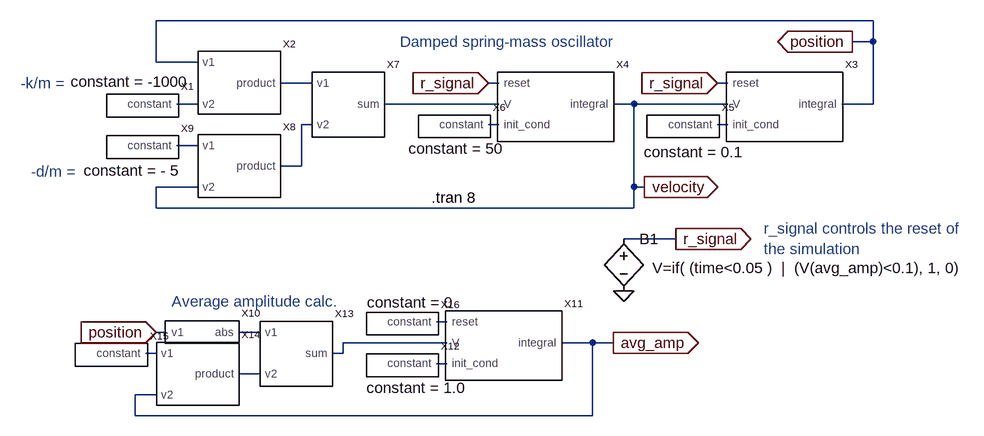
[diagram p0: schematic damped_osc_test.asc]
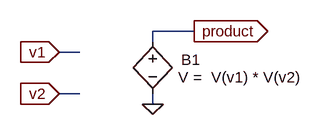
[diagram p1: sub-circuit multiplier_module.asc]
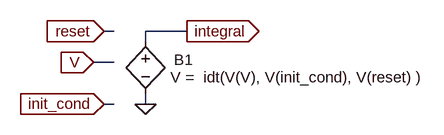
[diagram p2: sub-circuit integrator_module.asc]
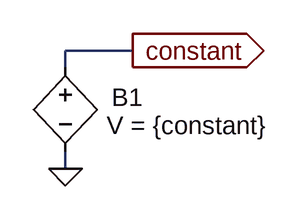
[diagram p3: sub-circuit constant_module.asc]
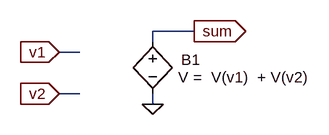
[diagram p4: sub-circuit sum_module.asc]
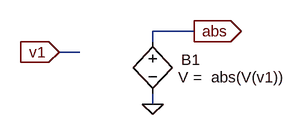
[diagram p5: sub-circuit abs_module.asc]
damped_osc_test.asc, the LTspice schematic file:
Version 4
SHEET 1 1332 680
WIRE 736 -256 -368 -256
WIRE 736 -224 736 -256
WIRE 736 -224 704 -224
WIRE -368 -192 -368 -256
WIRE -304 -192 -368 -192
WIRE -128 -160 -176 -160
WIRE 160 -160 144 -160
WIRE 512 -160 496 -160
WIRE -304 -128 -336 -128
WIRE 160 -128 -16 -128
WIRE 368 -128 336 -128
WIRE 512 -128 368 -128
WIRE 736 -128 736 -224
WIRE 736 -128 688 -128
WIRE -128 -96 -144 -96
WIRE 160 -96 144 -96
WIRE 512 -96 496 -96
WIRE -304 -64 -336 -64
WIRE -144 -32 -144 -96
WIRE -144 -32 -176 -32
WIRE -304 0 -368 0
WIRE 368 0 368 -128
WIRE 384 0 368 0
WIRE -368 32 -368 0
WIRE 368 32 368 0
WIRE 368 32 -368 32
WIRE 432 80 352 80
WIRE 80 208 64 208
WIRE -352 224 -368 224
WIRE -208 224 -240 224
WIRE 80 240 -80 240
WIRE 304 240 256 240
WIRE 336 240 304 240
WIRE -368 256 -384 256
WIRE -80 256 -80 240
WIRE -80 256 -96 256
WIRE 80 272 64 272
WIRE -208 288 -240 288
WIRE -368 320 -400 320
WIRE -400 352 -400 320
WIRE 304 352 304 240
WIRE 304 352 -400 352
FLAG 704 -224 position
IOPIN 704 -224 Out
FLAG 384 0 velocity
IOPIN 384 0 Out
FLAG 352 160 0
FLAG 432 80 r_signal
IOPIN 432 80 Out
FLAG 144 -160 r_signal
IOPIN 144 -160 In
FLAG 496 -160 r_signal
IOPIN 496 -160 In
FLAG -368 224 position
IOPIN -368 224 In
FLAG 336 240 avg_amp
IOPIN 336 240 Out
SYMBOL multiplier_module -208 -176 R0
SYMATTR InstName X2
SYMBOL integrator_module 656 -144 R0
SYMATTR InstName X3
SYMBOL integrator_module 304 -144 R0
SYMATTR InstName X4
SYMBOL constant_module 464 -112 R0
WINDOW 39 -81 58 Left 0
SYMATTR SpiceLine constant = 0.1
SYMATTR InstName X5
SYMBOL constant_module 112 -112 R0
WINDOW 39 -91 53 Left 0
SYMATTR SpiceLine constant = 50
SYMATTR InstName X6
SYMBOL constant_module -368 -144 R0
WINDOW 39 -131 -18 Left 0
SYMATTR SpiceLine constant = -1000
SYMATTR InstName X1
SYMBOL sum_module -48 -144 R0
SYMATTR InstName X7
SYMBOL multiplier_module -208 -48 R0
SYMATTR InstName X8
SYMBOL constant_module -368 -80 R0
WINDOW 39 -111 55 Left 0
SYMATTR SpiceLine constant = - 5
SYMATTR InstName X9
SYMBOL bv 352 64 R0
WINDOW 3 44 61 Left 0
SYMATTR Value V=if( (time<0.05 )  |  (V(avg_amp)<0.1), 1, 0)
SYMATTR InstName B1
SYMBOL abs_module -304 224 R0
SYMATTR InstName X10
SYMBOL integrator_module 224 224 R0
SYMATTR InstName X11
SYMBOL constant_module 32 256 R0
WINDOW 39 -76 53 Left 0
SYMATTR InstName X12
SYMATTR SpiceLine constant = 1.0
SYMBOL sum_module -128 240 R0
SYMATTR InstName X13
SYMBOL multiplier_module -272 272 R0
SYMATTR InstName X14
SYMBOL constant_module -416 240 R0
SYMATTR InstName X15
SYMATTR SpiceLine constant = - 0.95
SYMBOL constant_module 32 192 R0
WINDOW 39 -75 -14 Left 0
SYMATTR InstName X16
SYMATTR SpiceLine constant = 0
TEXT 56 16 Left 0 !.tran 8
TEXT 8 -224 Left 0 ;Damped spring-mass oscillator
TEXT -576 -160 Left 0 ;-k/m =
TEXT -560 -24 Left 0 ;-d/m =
TEXT 568 64 Left 0 ;r_signal controls the reset of\nthe simulation
TEXT -344 176 Left 0 ;Average amplitude calc.

multiplier_module.asc, the sub-circuit schematic file:
Version 4
SHEET 1 880 680
WIRE 240 160 176 160
WIRE 176 176 176 160
WIRE 64 192 32 192
WIRE 64 256 32 256
WIRE 176 272 176 256
FLAG 32 192 v1
IOPIN 32 192 In
FLAG 32 256 v2
IOPIN 32 256 In
FLAG 176 272 0
FLAG 240 160 product
IOPIN 240 160 Out
SYMBOL bv 176 160 R0
WINDOW 0 44 44 Left 0
WINDOW 3 39 71 Left 0
SYMATTR InstName B1
SYMATTR Value V =  V(v1) * V(v2)

integrator_module.asc, the sub-circuit schematic file:
Version 4
SHEET 1 880 680
WIRE 128 160 112 160
WIRE 240 160 176 160
WIRE 176 176 176 160
WIRE 128 208 96 208
WIRE 128 272 112 272
WIRE 176 272 176 256
FLAG 96 208 V
IOPIN 96 208 In
FLAG 176 272 0
FLAG 240 160 integral
IOPIN 240 160 Out
FLAG 112 272 init_cond
IOPIN 112 272 In
FLAG 112 160 reset
IOPIN 112 160 In
SYMBOL bv 176 160 R0
WINDOW 0 44 44 Left 0
WINDOW 3 39 71 Left 0
SYMATTR InstName B1
SYMATTR Value V =  idt(V(V), V(init_cond), V(reset) )

constant_module.asc, the sub-circuit schematic file:
Version 4
SHEET 1 880 680
WIRE 240 160 176 160
WIRE 176 176 176 160
WIRE 176 272 176 256
FLAG 176 272 0
FLAG 240 160 constant
IOPIN 240 160 Out
SYMBOL bv 176 160 R0
WINDOW 0 44 44 Left 0
WINDOW 3 39 71 Left 0
SYMATTR InstName B1
SYMATTR Value V = {constant}

sum_module.asc, the sub-circuit schematic file:
Version 4
SHEET 1 880 680
WIRE 240 160 176 160
WIRE 176 176 176 160
WIRE 64 192 32 192
WIRE 64 256 32 256
WIRE 176 272 176 256
FLAG 32 192 v1
IOPIN 32 192 In
FLAG 32 256 v2
IOPIN 32 256 In
FLAG 176 272 0
FLAG 240 160 sum
IOPIN 240 160 Out
SYMBOL bv 176 160 R0
WINDOW 0 44 44 Left 0
WINDOW 3 39 71 Left 0
SYMATTR InstName B1
SYMATTR Value V =  V(v1)  + V(v2)

abs_module.asc, the sub-circuit schematic file:
Version 4
SHEET 1 880 680
WIRE 240 160 176 160
WIRE 176 176 176 160
WIRE 64 192 32 192
WIRE 176 272 176 256
FLAG 32 192 v1
IOPIN 32 192 In
FLAG 176 272 0
FLAG 240 160 abs
IOPIN 240 160 Out
SYMBOL bv 176 160 R0
WINDOW 0 44 44 Left 0
WINDOW 3 39 71 Left 0
SYMATTR InstName B1
SYMATTR Value V =  abs(V(v1))

The netlist it stands for:
* damped_osc_test.asc
XX2 N001 position N002 multiplier_module
XX3 position velocity N006 r_signal integrator_module
XX4 velocity N003 N005 r_signal integrator_module
XX5 N006 constant_module params: constant = 0.1
XX6 N005 constant_module params: constant = 50
XX1 N002 constant_module params: constant = -1000
XX7 N003 N001 N004 sum_module
XX8 N004 N007 velocity multiplier_module
XX9 N007 constant_module params: constant = - 5
B1 r_signal 0 V=if( (time<0.05 )  |  (V(avg_amp)<0.1), 1, 0)
XX10 position N009 abs_module
XX11 avg_amp N010 N012 N008 integrator_module
XX12 N012 constant_module params: constant = 1.0
XX13 N010 N009 N013 sum_module
XX14 N013 N011 avg_amp multiplier_module
XX15 N011 constant_module params: constant = - 0.95
XX16 N008 constant_module params: constant = 0

* block symbol definitions
.subckt multiplier_module product v1 v2
B1 product 0 V =  V(v1) * V(v2)
.ends multiplier_module

.subckt integrator_module integral V init_cond reset
B1 integral 0 V =  idt(V(V), V(init_cond), V(reset) )
.ends integrator_module

.subckt constant_module constant
B1 constant 0 V = {constant}
.ends constant_module

.subckt sum_module sum v1 v2
B1 sum 0 V =  V(v1)  + V(v2)
.ends sum_module

.subckt abs_module v1 abs
B1 abs 0 V =  abs(V(v1))
.ends abs_module

.tran 8
* Damped spring-mass oscillator
* -k/m =
* -d/m =
* r_signal controls the reset of
* the simulation
* Average amplitude calc.
.backanno
.end